# Altium schematic sheet DDR3_2.SchDoc
size A4; DocumentNumber: 14; SheetNumber: 14; SheetTotal: 47
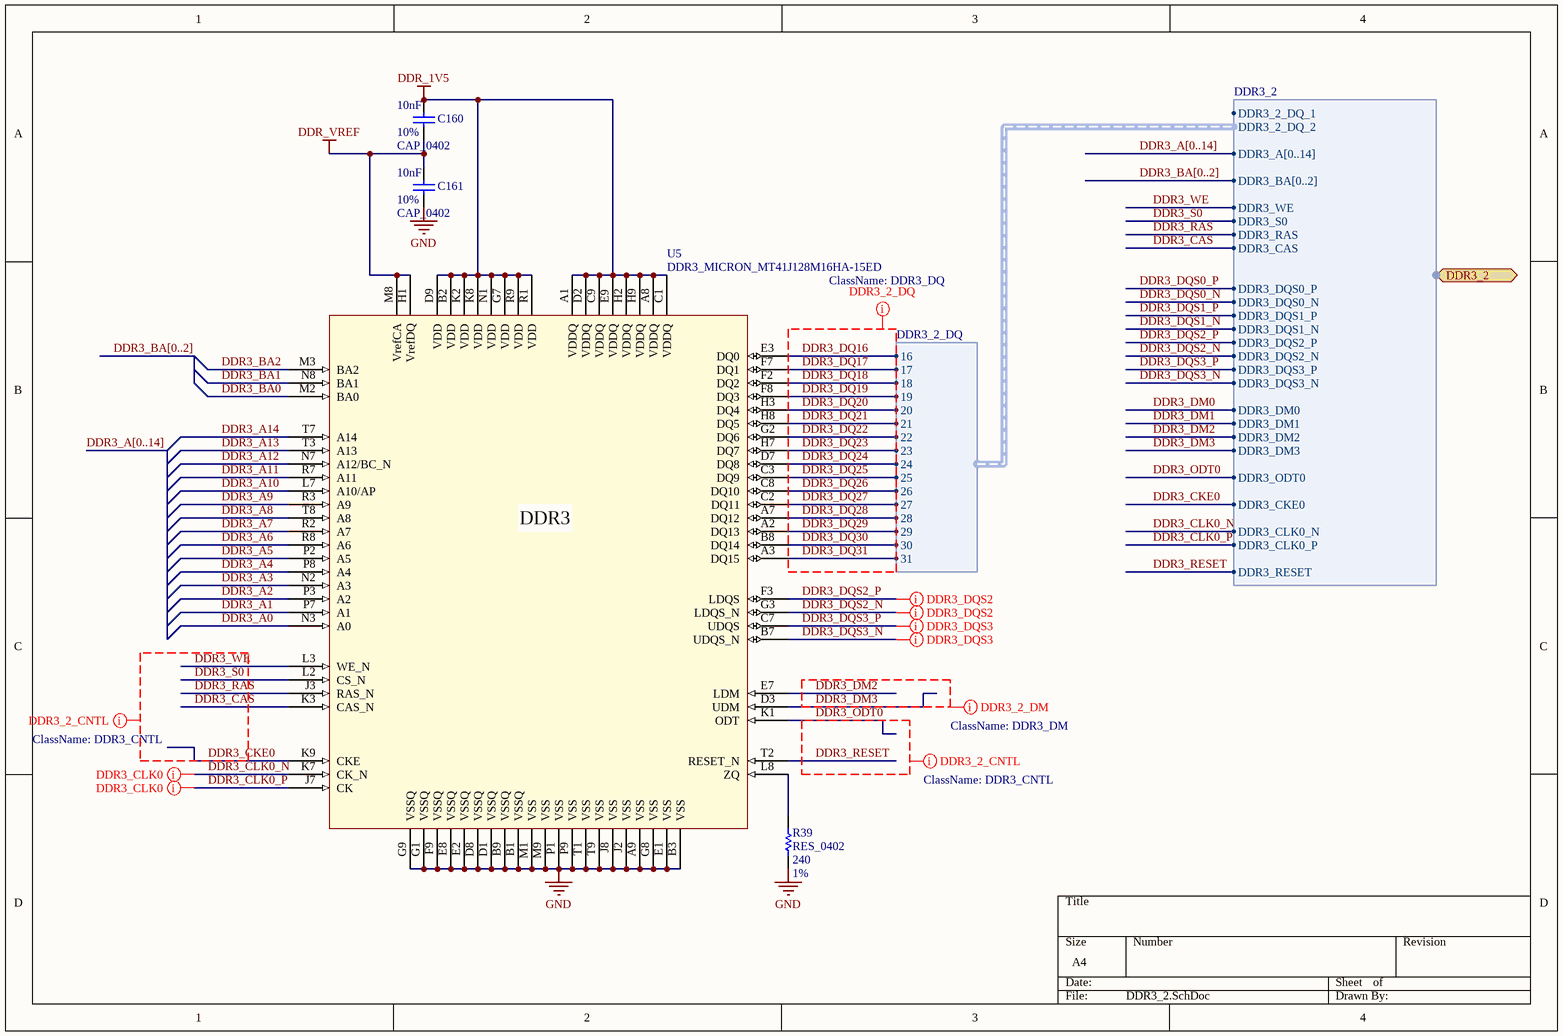
[diagram p0: DDR3_2.SchDoc]

## Parts
C160  CAP_0402  value 10nF  Tolerance: 10%  [CAPC0402(1005)60_N]
C161  CAP_0402  value 10nF  Tolerance: 10%  [CAPC0402(1005)60_N]
R39  RES_0402  value 240  Tolerance: 1%  [RESC0402(1005)_N]
U5  DDR3_MICRON_MT41J128M16HA-15ED  [DDR3_MICRON_MT41J128M16HA-15ED_FBGA96]

## Ports
DDR3_2 (harness DDR3_2)

## Harnesses
DDR3_2: DDR3_2_DQ_1, DDR3_2_DQ_2, DDR3_A[0..14], DDR3_BA[0..2], DDR3_WE, DDR3_S0, DDR3_RAS, DDR3_CAS, DDR3_DQS0_P, DDR3_DQS0_N, DDR3_DQS1_P, DDR3_DQS1_N, DDR3_DQS2_P, DDR3_DQS2_N, DDR3_DQS3_P, DDR3_DQS3_N, DDR3_DM0, DDR3_DM1, DDR3_DM2, DDR3_DM3, DDR3_ODT0, DDR3_CKE0, DDR3_CLK0_N, DDR3_CLK0_P, DDR3_RESET
DDR3_2_DQ: 16, 17, 18, 19, 20, 21, 22, 23, 24, 25, 26, 27, 28, 29, 30, 31

## Nets
DDR_1V5: C160.2 U5.A1(VDDQ) U5.A8(VDDQ) U5.B2(VDD) U5.C1(VDDQ) U5.C9(VDDQ) U5.D2(VDDQ) U5.D9(VDD) U5.E9(VDDQ) U5.G7(VDD) U5.H2(VDDQ) U5.H9(VDDQ) U5.K2(VDD) U5.K8(VDD) U5.N1(VDD) U5.R1(VDD) U5.R9(VDD)
DDR_VREF: C160.1 C161.2 U5.H1(VrefDQ) U5.M8(VrefCA)
GND: C161.1 R39.1 U5.A9(VSS) U5.B1(VSSQ) U5.B3(VSS) U5.B9(VSSQ) U5.D1(VSSQ) U5.D8(VSSQ) U5.E1(VSS) U5.E2(VSSQ) U5.E8(VSSQ) U5.F9(VSSQ) U5.G1(VSSQ) U5.G8(VSS) U5.G9(VSSQ) U5.J2(VSS) U5.J8(VSS) U5.M1(VSS) U5.M9(VSS) U5.P1(VSS) U5.P9(VSS) U5.T1(VSS) U5.T9(VSS)
DDR3_A0: U5.N3(A0)
DDR3_A1: U5.P7(A1)
DDR3_A2: U5.P3(A2)
DDR3_A3: U5.N2(A3)
DDR3_A4: U5.P8(A4)
DDR3_A5: U5.P2(A5)
DDR3_A6: U5.R8(A6)
DDR3_A7: U5.R2(A7)
DDR3_A8: U5.T8(A8)
DDR3_A9: U5.R3(A9)
DDR3_A10: U5.L7(A10/AP)
DDR3_A11: U5.R7(A11)
DDR3_A12: U5.N7(A12/BC_N)
DDR3_A13: U5.T3(A13)
DDR3_A14: U5.T7(A14)
DDR3_BA0: U5.M2(BA0)
DDR3_BA1: U5.N8(BA1)
DDR3_BA2: U5.M3(BA2)
DDR3_CAS: U5.K3(CAS_N) ; port DDR3_2.DDR3_CAS
DDR3_CKE0: U5.K9(CKE) ; port DDR3_2.DDR3_CKE0
DDR3_CLK0_N: U5.K7(CK_N) ; port DDR3_2.DDR3_CLK0_N
DDR3_CLK0_P: U5.J7(CK) ; port DDR3_2.DDR3_CLK0_P
DDR3_DM0: port DDR3_2.DDR3_DM0
DDR3_DM1: port DDR3_2.DDR3_DM1
DDR3_DM2: U5.E7(LDM) ; port DDR3_2.DDR3_DM2
DDR3_DM3: U5.D3(UDM) ; port DDR3_2.DDR3_DM3
DDR3_DQ16: U5.E3(DQ0) ; harness DDR3_2_DQ.16
DDR3_DQ17: U5.F7(DQ1) ; harness DDR3_2_DQ.17
DDR3_DQ18: U5.F2(DQ2) ; harness DDR3_2_DQ.18
DDR3_DQ19: U5.F8(DQ3) ; harness DDR3_2_DQ.19
DDR3_DQ20: U5.H3(DQ4) ; harness DDR3_2_DQ.20
DDR3_DQ21: U5.H8(DQ5) ; harness DDR3_2_DQ.21
DDR3_DQ22: U5.G2(DQ6) ; harness DDR3_2_DQ.22
DDR3_DQ23: U5.H7(DQ7) ; harness DDR3_2_DQ.23
DDR3_DQ24: U5.D7(DQ8) ; harness DDR3_2_DQ.24
DDR3_DQ25: U5.C3(DQ9) ; harness DDR3_2_DQ.25
DDR3_DQ26: U5.C8(DQ10) ; harness DDR3_2_DQ.26
DDR3_DQ27: U5.C2(DQ11) ; harness DDR3_2_DQ.27
DDR3_DQ28: U5.A7(DQ12) ; harness DDR3_2_DQ.28
DDR3_DQ29: U5.A2(DQ13) ; harness DDR3_2_DQ.29
DDR3_DQ30: U5.B8(DQ14) ; harness DDR3_2_DQ.30
DDR3_DQ31: U5.A3(DQ15) ; harness DDR3_2_DQ.31
DDR3_DQS0_N: port DDR3_2.DDR3_DQS0_N
DDR3_DQS0_P: port DDR3_2.DDR3_DQS0_P
DDR3_DQS1_N: port DDR3_2.DDR3_DQS1_N
DDR3_DQS1_P: port DDR3_2.DDR3_DQS1_P
DDR3_DQS2_N: U5.G3(LDQS_N) ; port DDR3_2.DDR3_DQS2_N
DDR3_DQS2_P: U5.F3(LDQS) ; port DDR3_2.DDR3_DQS2_P
DDR3_DQS3_N: U5.B7(UDQS_N) ; port DDR3_2.DDR3_DQS3_N
DDR3_DQS3_P: U5.C7(UDQS) ; port DDR3_2.DDR3_DQS3_P
DDR3_ODT0: U5.K1(ODT) ; port DDR3_2.DDR3_ODT0
DDR3_RAS: U5.J3(RAS_N) ; port DDR3_2.DDR3_RAS
DDR3_RESET: U5.T2(RESET_N) ; port DDR3_2.DDR3_RESET
DDR3_S0: U5.L2(CS_N) ; port DDR3_2.DDR3_S0
DDR3_WE: U5.L3(WE_N) ; port DDR3_2.DDR3_WE
NetR39_2: R39.2 U5.L8(ZQ)

## Buses and harness runs
bus DDR3_A[0..14]
bus DDR3_BA[0..2]

## Layout directives
differential pair: DDR3_CLK0_N, DDR3_CLK0_P, DDR3_DQS2_N, DDR3_DQS2_P, DDR3_DQS3_N, DDR3_DQS3_P
net class DDR3_DQ: DDR3_DQ16, DDR3_DQ17, DDR3_DQ18, DDR3_DQ19, DDR3_DQ20, DDR3_DQ21, DDR3_DQ22, DDR3_DQ23, DDR3_DQ24, DDR3_DQ25, DDR3_DQ26, DDR3_DQ27, DDR3_DQ28, DDR3_DQ29, DDR3_DQ30, DDR3_DQ31
net class DDR3_DM: DDR3_DM2, DDR3_DM3
net class DDR3_CNTL: DDR3_CAS, DDR3_CKE0, DDR3_ODT0, DDR3_RAS, DDR3_RESET, DDR3_S0, DDR3_WE

## Notes on the sheet
- (in symbol MT41J128M16HA-15E:D TR) DDR3

## Library data of the parts
C160 C161 = CAP_0402: 10000pF, ceramic, 10% 6.3V X5R, 0402; Part Number: GRM155R60J103KA01D; Manufacturer: Murata Electronics North America; Footprint Ref: CAPC0402(1005)60_N; Library Ref: CAP_0402
R39 = RES_0402: 240 ohm, 1% 1/16W, 0402; Part Number: CRCW0402240RFKED; Manufacturer: Vishay/Dale; Library Ref: RES_0402; Footprint Ref: RESC0402(1005)_N
U5 = MT41J128M16HA-15E:D TR: MT41J128M16HA-15E:D, DDR3 SDRAM 4Gb x4, x8, x16, FBGA96; Manufacturer: MICRON; Part Number: MT41J128M16HA-15E:D TR